# EAGLE schematic user_prog_jig_pcb v42 (EAGLE 9.7.0)
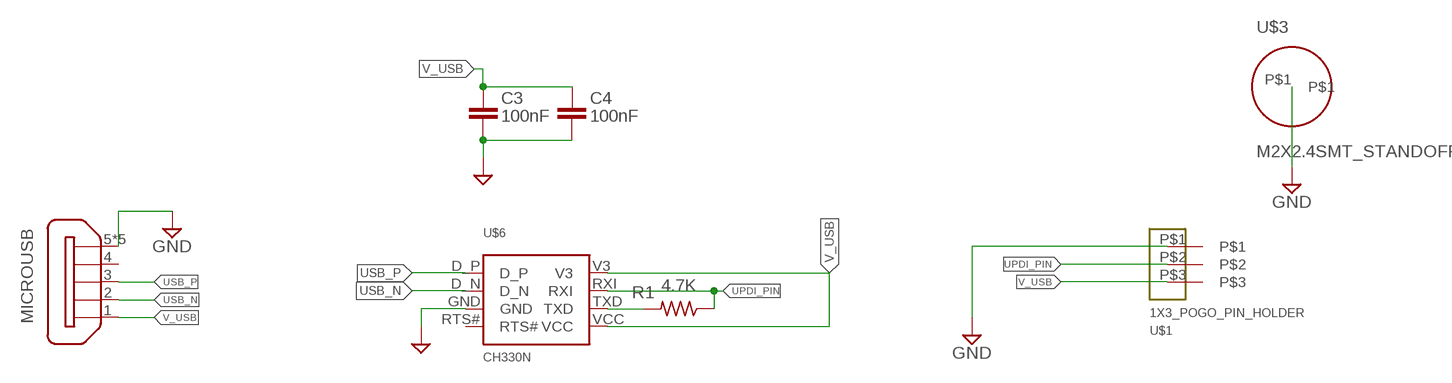
[diagram p0: schematic, sheet 1]

## Parts
C3  100nF  C_CHIP-0402(1005-METRIC)  [CAPC1005X60]
C4  100nF  C_CHIP-0402(1005-METRIC)  [CAPC1005X60]
R1  4.7K  R-US_CHIP-0402(1005-METRIC)  [RESC1005X40]
U$1  1X3_POGO_PIN_HOLDER  [1X3_POGO_PIN_HOLDER]
U$3  M2X2.4SMT_STANDOFF  [M2X2.4SMT_STANDOFF]
U$6  CH330N  [CH330N]
UPDI  MICROUSB  [ZX62D-B-5PA8]

## Nets
GND: C3.2 C4.2 U$1.P$1 U$3.P$1 U$6.GND UPDI.5 UPDI.S1 UPDI.S2 UPDI.S3 UPDI.S4
N$4: R1.2 U$6.TXD
UPDI_PIN: R1.1 U$1.P$2 U$6.RXI
USB_N: U$6.D_N UPDI.2
USB_P: U$6.D_P UPDI.3
V_USB: C3.1 C4.1 U$1.P$3 U$6.V3 U$6.VCC UPDI.1
Unconnected: U$6.RTS# UPDI.4

## Library data of the parts
C3 C4 = MY_CAP_LIB:C: Capacitor - Generic; CATEGORY: Capacitor
R1 = resistor:R-US: Resistor Fixed - ANSI; CATEGORY: Resistor; SUB-CATEGORY: Fixed
U$1 = MY_CLOCK_LIB_COMPONENTS:1X3_POGO_PIN_HOLDER
U$3 = BIY_mycustomDevices copy:M2X2.4SMT_STANDOFF
U$6 = MY_CLOCK_LIB_COMPONENTS:CH330N
UPDI = MY_CLOCK_LIB_COMPONENTS:MICROUSB